# EAGLE design potenci (EAGLE 4.11)
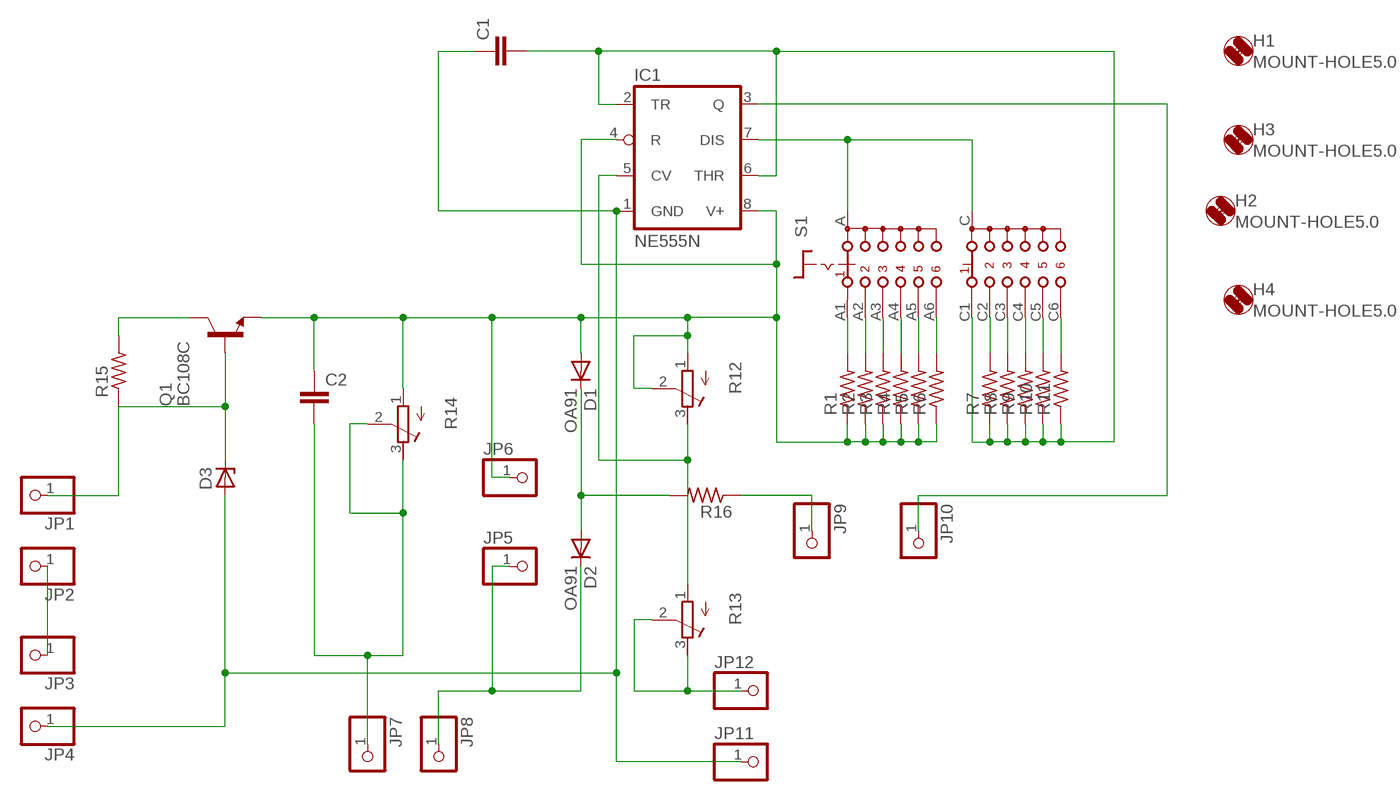
[diagram p0: schematic, sheet 1]

## Parts
C1  C-EU050-025X075  [C050-025X075]
C2  C-EU050-025X075  [C050-025X075]
D1  OA91  [DO07]
D2  OA91  [DO07]
D3  ZENER-DIODEZD-7.5  [ZDIO-7.5]
H1  MOUNT-HOLE5.0  [5,0]
H2  MOUNT-HOLE5.0  [5,0]
H3  MOUNT-HOLE5.0  [5,0]
H4  MOUNT-HOLE5.0  [5,0]
IC1  NE555N  [DIL08]
JP1  PINHD-1X1  [1X01]
JP2  PINHD-1X1  [1X01]
JP3  PINHD-1X1  [1X01]
JP4  PINHD-1X1  [1X01]
JP5  PINHD-1X1  [1X01]
JP6  PINHD-1X1  [1X01]
JP7  PINHD-1X1  [1X01]
JP8  PINHD-1X1  [1X01]
JP9  PINHD-1X1  [1X01]
JP10  PINHD-1X1  [1X01]
JP11  PINHD-1X1  [1X01]
JP12  PINHD-1X1  [1X01]
Q1  BC108C  [TO18]
R1  R-US_0207/10  [0207/10]
R2  R-US_0207/10  [0207/10]
R3  R-US_0207/10  [0207/10]
R4  R-US_0207/10  [0207/10]
R5  R-US_0207/10  [0207/10]
R6  R-US_0207/10  [0207/10]
R7  R-US_0207/10  [0207/10]
R8  R-US_0207/10  [0207/10]
R9  R-US_0207/10  [0207/10]
R10  R-US_0207/10  [0207/10]
R11  R-US_0207/10  [0207/10]
R12  R-TRIMM64Y  [RTRIM64Y]
R13  R-TRIMM64Y  [RTRIM64Y]
R14  R-TRIMM64Y  [RTRIM64Y]
R15  R-US_0207/10  [0207/10]
R16  R-US_0207/10  [0207/10]
S1  CK102X06  [CK102X06]

## Nets
N$1: IC1.7(DIS) S1.A S1.C
N$2: C2.1 D1.A IC1.4(R) IC1.8(V+) JP6.1 Q1.1(E) R1.1 R2.1 R3.1 R4.1 R5.1 R6.1 R12.1(E) R12.2(S) R14.1(E)
N$3: C1.2 IC1.2(TR) IC1.6(THR) R7.1 R8.1 R9.1 R10.1 R11.1 S1.C1
N$4: R11.2 S1.C6
N$5: R10.2 S1.C5
N$6: R9.2 S1.C4
N$7: R8.2 S1.C3
N$8: R7.2 S1.C2
N$9: R6.2 S1.A6
N$10: R5.2 S1.A5
N$11: R4.2 S1.A4
N$12: R3.2 S1.A3
N$13: R2.2 S1.A2
N$14: R1.2 S1.A1
N$16: JP9.1 R16.1
N$17: Q1.3(C) R15.2
N$18: D3.C JP1.1 Q1.2(B) R15.1
N$19: C1.1 D3.A IC1.1(GND) JP4.1 JP11.1
N$20: JP2.1 JP3.1
N$21: C2.2 JP7.1 R14.2(S) R14.3(A)
N$22: D1.C D2.A R16.2
N$23: D2.C JP5.1 JP8.1
N$24: IC1.3(Q) JP10.1
N$25: IC1.5(CV) R12.3(A) R13.1(E)
N$27: JP12.1 R13.2(S) R13.3(A)

## Library data of the parts
C1 C2 = rcl:C-EU: CAPACITOR, European symbol
D1 D2 = diode:OA91: DIODE germanium signal diode 115 V 50 mA
D3 = diode:ZENER-DIODE: Z-Diode
H1-H4 = holes:MOUNT-HOLE: MOUNTING HOLE with drill center marker
IC1 = linear:*555: TIMER
JP1-JP12 = pinhead:PINHD-1X1: PIN HEADER
Q1 = transistor-npn:BC108C: NPN Transistor
R1-R11 R15 R16 = rcl:R-US_: RESISTOR, American symbol
R12-R14 = rcl:R-TRIMM: Trimm resistor
S1 = switch:CK102X06: ROTARY SWITCH C&K

## Board
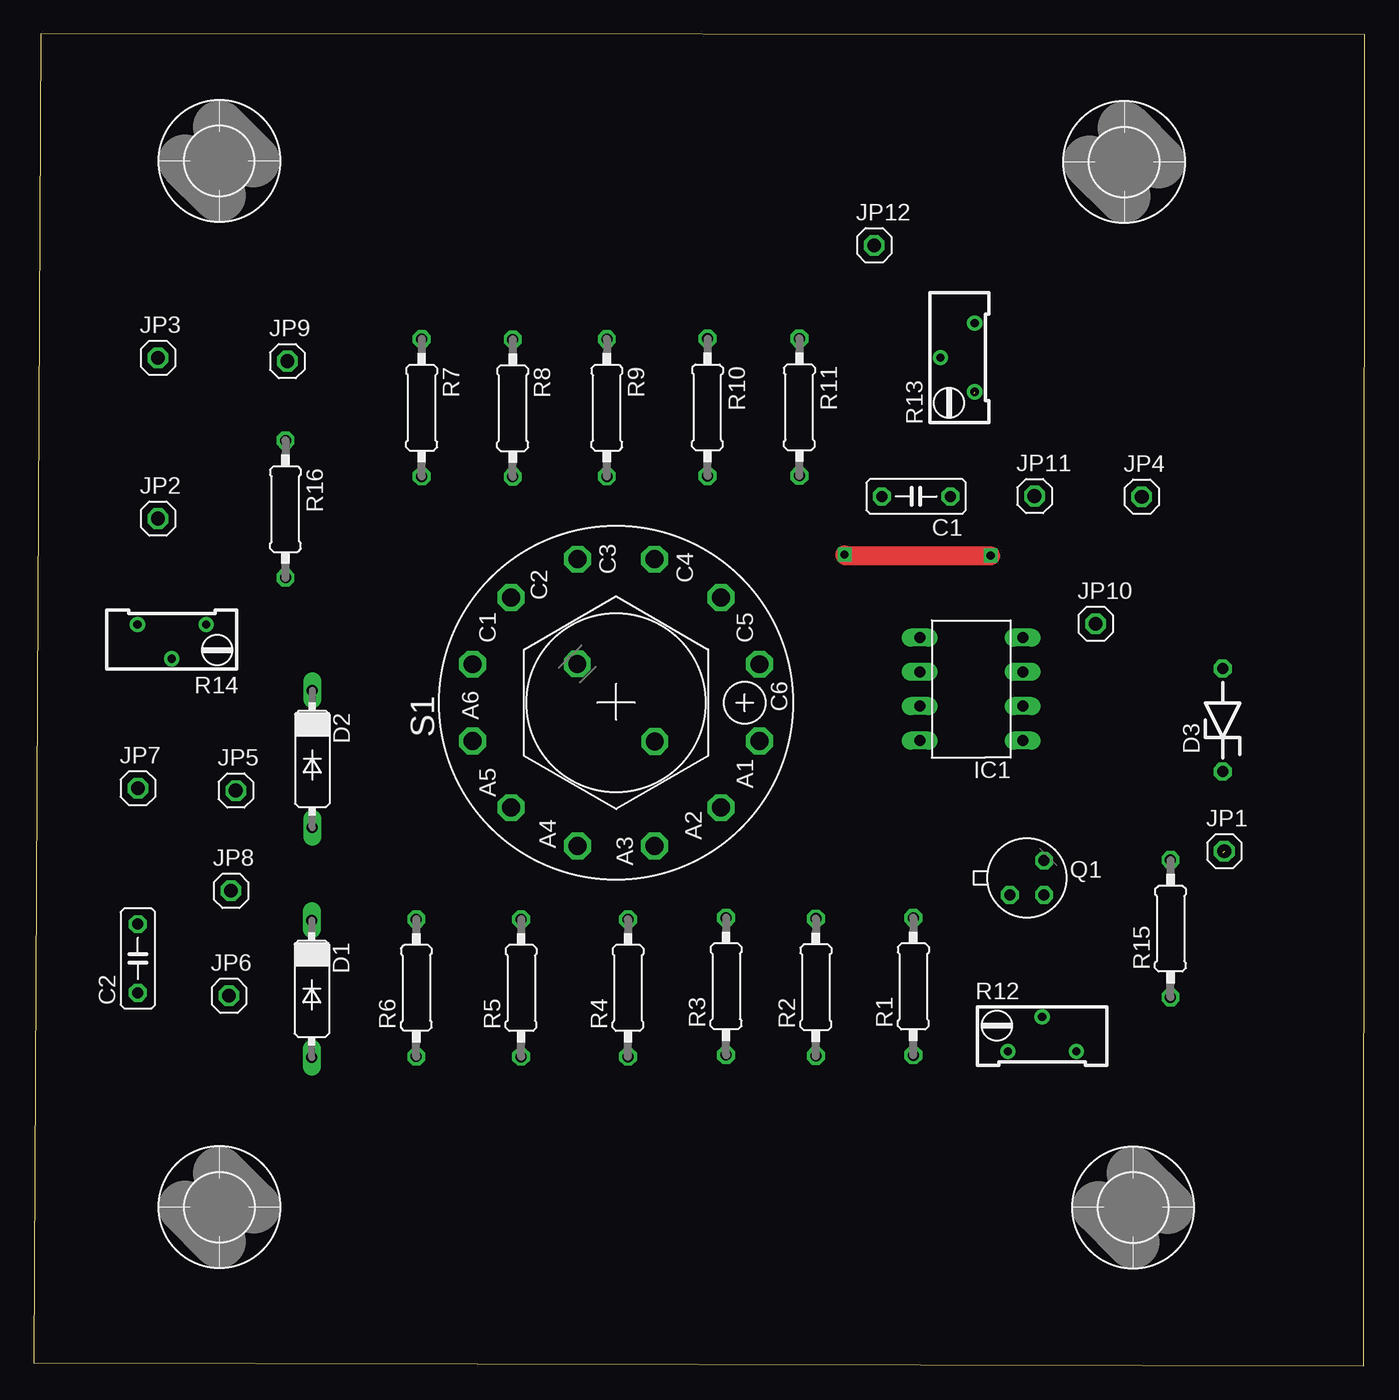
[diagram p1: board, top side]
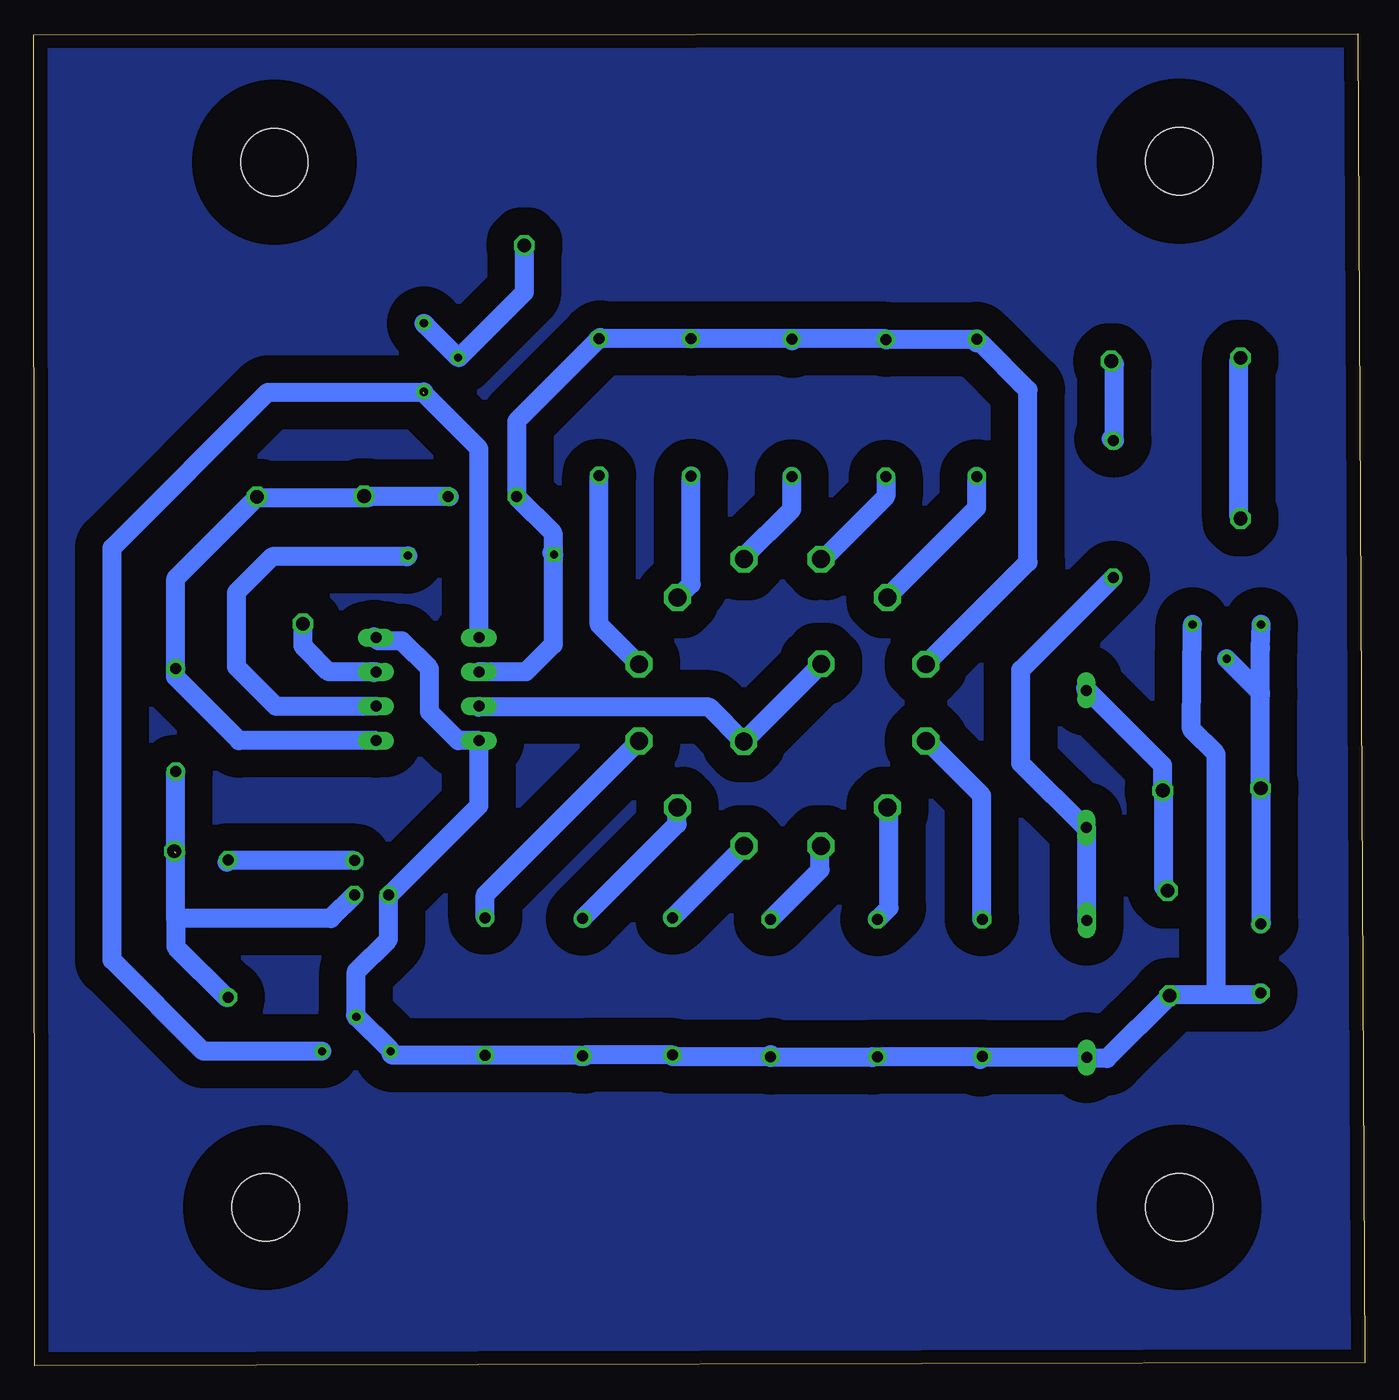
[diagram p2: board, bottom side, seen from below]

Size 98.52 x 98.59 mm. Coordinates in mm from the lower left corner, seen from the top.
Outline: 0,0.22 98.43,0 98.52,98.5 0.51,98.59 0,0.22
Copper layers (1*16): Top 0.035mm / dielectric 1.5mm / Bottom 0.035mm
Design rules "default": minimum track width 10mil, minimum drill 24mil, track to track 80mil, track to pad 30mil, pad to pad 30mil, via to via 30mil, smd to smd 30mil, copper to edge 40mil, drill to drill 8mil, minimum pad ring 10mil, minimum via ring 8mil, stop-mask expansion 4mil, vias tented up to drill 0mil, thermal gap 10mil

### Footprints (pad centres in the part's own frame; a part is rotated, then mirrored left to right if it is on the bottom)
C050-025X075 = drill 0.813 octagon: 1 -2.54,0; 2 2.54,0
DO07 = drill 0.813 long: A 5.08,0; C -5.08,0
ZDIO-7.5 = drill 0.813 octagon: A 3.81,0; C -3.81,0
5,0 = hole 5: 0,0
DIL08 = drill 0.813 long: 1 -3.81,-3.81; 2 -1.27,-3.81; 3 1.27,-3.81; 4 3.81,-3.81; 5 3.81,3.81; 6 1.27,3.81; 7 -1.27,3.81; 8 -3.81,3.81
1X01 = drill 1.016 octagon: 1 0,0
TO18 = drill 0.813 octagon: 1 -1.27,-1.27; 2 1.27,-1.27; 3 1.27,1.27
0207/10 = drill 0.813 octagon: 1 -5.08,0; 2 5.08,0
RTRIM64Y = drill 0.61 round: 1 0,-2.54; 2 -2.54,0; 3 0,2.54
CK102X06 = drill 1.321 octagon: A -2.87,-2.87; A1 -2.845,-10.617; A2 -7.772,-7.772; A3 -10.617,-2.845; A4 -10.617,2.845; A5 -7.772,7.772; A6 -2.845,10.617; C 2.87,2.87; C1 2.845,10.617; C2 7.772,7.772; C3 10.617,2.845; C4 10.617,-2.845; C5 7.772,-7.772; C6 2.845,-10.617

### Placement (x,y rotation side)
C1  65.31,64.34 180 top
C2  7.7,30.15 90 top
D1  20.57,27.89 270 top
D2  20.61,44.92 270 top
D3  88.01,47.79 90 top
H1  81.37,11.71 0 top
H2  13.73,89.17 0 top
H3  13.74,11.73 0 top
H4  80.71,89.09 0 top
IC1  69.39,50.09 90 top
JP1  88.12,38.08 0 top
JP2  9.19,62.7 0 top
JP3  9.19,74.6 0 top
JP4  82.01,64.32 0 top
JP5  14.95,42.58 0 top
JP6  14.44,27.39 0 top
JP7  7.7,42.74 0 top
JP8  14.6,35.16 0 top
JP9  18.77,74.36 0 top
JP10  78.6,54.91 0 top
JP11  74.07,64.37 0 top
JP12  62.2,82.93 0 top
Q1  73.52,36.12 0 top
R1  65.1,28.07 90 top
R2  57.89,28.02 90 top
R3  51.25,28.07 90 top
R4  43.99,27.96 90 top
R5  36.07,27.96 90 top
R6  28.31,27.96 90 top
R7  28.72,70.91 270 top
R8  35.45,70.89 270 top
R9  42.42,70.91 270 top
R10  49.87,70.94 270 top
R11  56.67,70.96 270 top
R12  74.64,23.28 270 top
R13  69.65,74.63 0 top
R14  10.21,54.87 90 top
R15  84.14,32.35 90 top
R16  18.63,63.41 270 top
S1  43.1,49.08 90 top

### Tracks (layer width: path | path; a pad name or v marks a point on that pad's centre or on a via)
N$1
  Bottom 1.422: S1.C 45.89,46.3 45.89,46.2 45.96,46.2 S1.A 48.52,48.76 65.62,48.76 65.62,48.78 IC1.7
N$2
  Bottom 1.422: 28.45,22.88 R6.1 | 28.45,22.88 R5.1 36.45,22.88 36.45,22.82 43.98,22.82 R4.1 | 28.45,22.82 28.45,22.88 | 28.45,22.82 28.45,22.66 | R4.1 43.98,23.04 | R4.1 51.21,22.88 51.21,22.99 R3.1 57.76,22.99 57.76,22.93 | 57.76,22.93 57.76,22.89 | 57.76,22.89 | 57.76,22.93 R2.1 | 57.76,22.89 58.04,22.89 58.13,22.99 R1.1 71.98,22.99 72.1,23.11 R12.1 72.1,23.33 74.64,25.87 | 28.45,22.82 D1.A 20.51,22.75 20.51,22.74 19.08,22.74 JP6.1 14.37,27.46 11.15,27.46 | C2.1 7.72,27.61 7.87,27.46 11.15,27.46 | R14.1 12.83,47.11 10.99,45.27 10.99,27.61 11.15,27.46 | 74.64,25.87 74.71,25.94 | 74.64,25.87 R12.2 74.64,29.2 72.27,31.57 72.27,34.69 72.19,34.77 72.25,34.82 Q1.1 72.19,34.84 65.58,41.46 IC1.8 67.11,46.28 69.23,48.39 69.23,51.59 71.28,53.65 73.03,53.65 73.29,53.9 | 73.29,53.9 73.34,53.95 | 73.29,53.9 IC1.4
N$3  (via drill 0.61)
  Top 1.422: v70.82,59.96 60.09,59.96 v60.02,60.04
  Bottom 1.422: 42.4,75.99 42.4,75.86 | 42.4,75.99 R9.1 | 42.4,76.02 R10.1 56.74,76.02 56.82,75.95 56.78,75.91 | 42.4,76.02 42.4,75.99 | S1.C1 24.92,59.49 24.92,72.22 28.43,75.72 28.73,75.72 28.73,75.97 R7.1 28.68,75.95 | 42.4,76.02 35.43,76.02 35.43,75.99 R8.1 35.44,75.95 28.68,75.95 | 28.68,75.95 28.65,75.95 | 56.65,76.04 56.59,76.1 | 56.65,76.04 R11.1 | 56.78,75.91 62.77,69.92 C1.2 60.09,61.66 60.09,60.17 | 56.78,75.91 56.65,76.04 | 56.78,75.91 | IC1.2 80.61,48.82 83.54,51.74 83.54,57.22 80.87,59.89 70.9,59.89 v70.82,59.96 | v60.02,60.04 60.09,60.12 60.09,60.17 | IC1.6 62.1,51.36 60.08,53.38 60.08,60.09 60.16,60.17 60.09,60.17
N$4
  Bottom 1.422: 53.72,51.9 53.71,51.9 | S1.C6 53.72,51.9 | R11.2 56.67,54.86 53.72,51.9
N$5
  Bottom 1.422: S1.C5 51.07,56.66 | S1.C5 | R10.2 49.87,57.86 S1.C5
N$6
  Bottom 1.422: S1.C4 46.01,59.7 46.05,59.74 42.42,63.37 R9.2
N$7
  Bottom 1.422: S1.C3 40.19,59.7 40.15,59.65 35.45,64.34 R8.2
N$8
  Bottom 1.422: S1.C2 35.33,56.89 28.72,63.5 R7.2
N$9
  Bottom 1.422: R6.2 28.34,33.04 28.34,42.21 32.48,46.35 S1.A6
N$10
  Bottom 1.422: S1.A5 35.31,41.33 35.21,41.33 35.21,33.9 R5.2
N$11
  Bottom 1.422: 40.32,38.53 40.32,38.6 | 40.32,38.53 S1.A4 | R4.2 40.32,36.7 40.32,38.53
N$12
  Bottom 1.422: S1.A3 45.96,38.45 45.96,38.33 46.07,38.33 R3.2
N$13
  Bottom 1.422: S1.A2 50.89,41.33 50.9,41.33 50.9,40.08 R2.2
N$14
  Bottom 1.422: S1.A1 65.1,34.86 R1.2
N$15
  pour Bottom: 0.07,0.08 0.07,99.08 99.07,99.08 99.07,0.08
N$16
  Bottom 1.422: 18.76,68.62 R16.1 18.53,68.49 18.53,74.12 JP9.1
N$17
  Bottom 1.422: 84.14,37.36 84.22,37.28 | 84.14,37.36 R15.2 | Q1.3 84.12,37.38 84.14,37.36
N$18  (1 unrouted)
  Bottom 1.422: R15.1 84.18,27.27 84.22,27.23 88.01,31.02 88.01,33.09 | 88.01,33.09 88.01,37.97 D3.C | 88.01,33.09 88.03,33.09 | Q1.2 76.54,33.09 88.01,33.09
N$19
  Bottom 1.422: 67.82,64.34 67.78,64.3 | 67.82,64.34 C1.1 | 73.69,64.37 67.85,64.37 67.82,64.34 | 73.69,64.37 JP11.1 | 73.69,64.37 73.69,64.27 81.96,64.27 JP4.1 82.01,64.28 88,58.29 D3.A 88,51.05 88.05,51.01 83.32,46.28 IC1.1
N$20
  Bottom 1.422: JP2.1 9.32,62.83 9.32,74.47 JP3.1
N$21
  Bottom 1.422: C2.2 7.64,32.74 7.64,42.68 7.65,42.68 JP7.1 7.72,42.76 7.72,49.61 | 7.72,53.07 7.72,53.19 | 7.72,53.07 R14.3 | 7.72,49.61 7.72,53.07 | R14.2 7.72,49.83 7.72,49.61
N$22
  Bottom 1.422: D2.A 20.59,39.81 20.59,39.72 | D1.C 20.59,32.99 20.59,39.72 | R16.2 25.46,51.5 25.46,44.59 20.59,39.72
N$23
  Bottom 1.422: 20.61,50.1 20.66,50.14 | 20.61,50.1 D2.C | 20.61,50.1 14.95,44.43 JP5.1 14.88,42.5 14.88,35.43 JP8.1
N$24
  Bottom 1.422: JP10.1 78.6,53.28 76.69,51.36 73.41,51.36 73.34,51.29 73.26,51.36 IC1.3
N$25  (1 unrouted)
  Bottom 1.422: R12.3 85.97,23.28 92.72,30.03 92.72,60.53 81.2,72.06 69.67,72.06 R13.1 | IC1.5 65.58,67.89 69.63,71.94
N$27
  Bottom 1.422: R13.3 69.56,77.08 69.56,77.03 69.51,77.03 R13.2 67.03,74.63 62.2,79.45 JP12.1